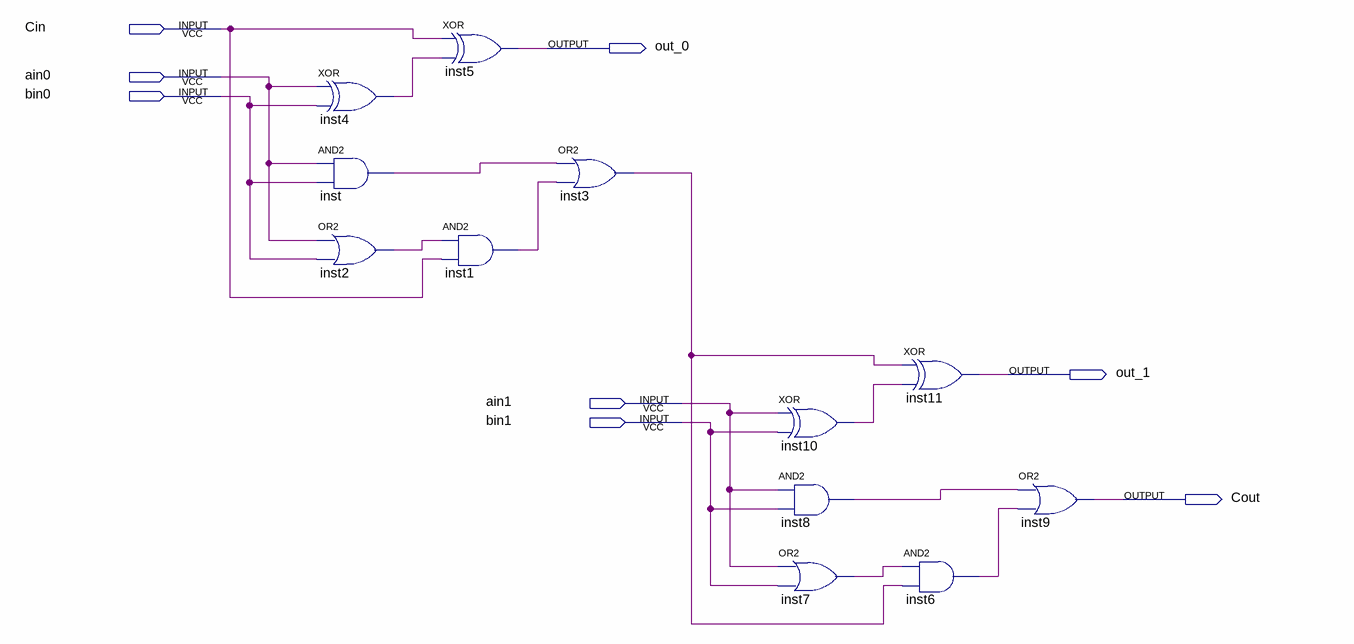
[diagram p0: schematic sheet]
// Quartus schematic Somador.bdf as structural Verilog: 12 symbols, 8 pins
module Somador (
  input  Cin,
  input  ain0,
  input  bin0,
  input  ain1,
  input  bin1,
  output out_0,
  output out_1,
  output Cout
);

  wire inst1_out, inst2_out, inst3_out, inst4_out, inst6_out, inst7_out, inst8_out, inst10_out, inst_out;

  xor inst4 (inst4_out, ain0, bin0);
  and inst (inst_out, ain0, bin0);
  or inst2 (inst2_out, ain0, bin0);
  xor inst5 (out_0, Cin, inst4_out);
  and inst1 (inst1_out, inst2_out, Cin);
  or inst3 (inst3_out, inst_out, inst1_out);
  xor inst10 (inst10_out, ain1, bin1);
  and inst8 (inst8_out, ain1, bin1);
  or inst7 (inst7_out, ain1, bin1);
  xor inst11 (out_1, inst3_out, inst10_out);
  and inst6 (inst6_out, inst7_out, inst3_out);
  or inst9 (Cout, inst8_out, inst6_out);
endmodule
